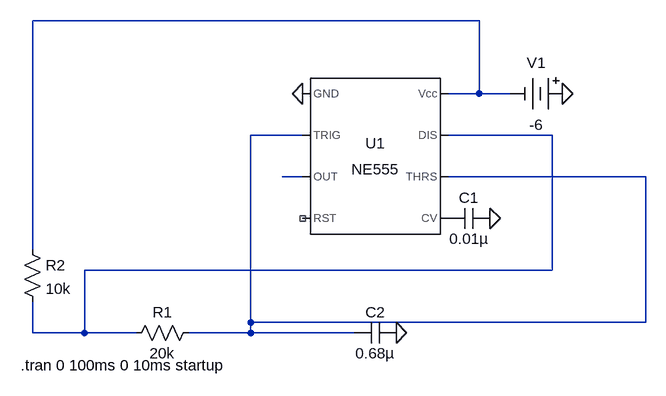
[diagram p0: schematic Draft5.asc]
Draft5.asc, the LTspice schematic file:
Version 4
SHEET 1 880 680
WIRE 464 16 -224 16
WIRE 464 128 464 16
WIRE 464 128 416 128
WIRE 512 128 464 128
WIRE 192 192 112 192
WIRE 576 192 416 192
WIRE 192 256 160 256
WIRE 720 256 416 256
WIRE -224 368 -224 16
WIRE 576 400 576 192
WIRE 576 400 -144 400
WIRE 112 480 112 192
WIRE 720 480 720 256
WIRE 720 480 112 480
WIRE -224 496 -224 448
WIRE -144 496 -144 400
WIRE -144 496 -224 496
WIRE -64 496 -144 496
WIRE 112 496 112 480
WIRE 112 496 16 496
WIRE 272 496 112 496
FLAG 480 320 0
FLAG 192 128 0
FLAG 336 496 0
FLAG 592 128 0
SYMBOL Misc\\NE555 304 224 R0
SYMATTR InstName U1
SYMBOL cap 480 304 R90
WINDOW 0 0 32 VBottom 2
WINDOW 3 32 32 VTop 2
SYMATTR InstName C1
SYMATTR Value 0.01µ
SYMATTR SpiceLine V=6.3 Irms=247m Rser=0.759039 Lser=0 mfg="KEMET" pn="C0603C103K9RAC" type="X7R"
SYMBOL Misc\\battery 608 128 R90
WINDOW 0 -32 56 VBottom 2
WINDOW 3 32 56 VTop 2
WINDOW 123 0 0 Left 0
WINDOW 39 0 0 Left 0
SYMATTR InstName V1
SYMATTR Value -6
SYMBOL res 32 480 R90
WINDOW 0 0 56 VBottom 2
WINDOW 3 32 56 VTop 2
SYMATTR InstName R1
SYMATTR Value 20k
SYMBOL cap 336 480 R90
WINDOW 0 0 32 VBottom 2
WINDOW 3 32 32 VTop 2
SYMATTR InstName C2
SYMATTR Value 0.68µ
SYMATTR SpiceLine V=6.3 Irms=0 Rser=0.0104593 Lser=347.341p mfg="Würth Elektronik" pn="885012106002 WCAP-CSGP 0603" type="X5R"
SYMBOL res -240 352 R0
SYMATTR InstName R2
SYMATTR Value 10k
TEXT -242 546 Left 2 !.tran 0 100ms 0 10ms startup

The netlist it stands for:
* Draft5.asc
XU1 0 N002 N004 NC_01 P001 N002 N003 N001 NE555  ; pins GND TRIG OUT RST CV THRS DIS Vcc
C1 0 P001 0.01µ V=6.3 Irms=247m Rser=0.759039 Lser=0 mfg="KEMET" pn="C0603C103K9RAC" type="X7R"
V1 0 N001 -6
R1 N002 N003 20k
C2 0 N002 0.68µ V=6.3 Irms=0 Rser=0.0104593 Lser=347.341p mfg="Würth Elektronik" pn="885012106002 WCAP-CSGP 0603" type="X5R"
R2 N001 N003 10k
.tran 0 100ms 0 10ms startup
.lib NE555.sub
.backanno
.end